# EAGLE design avr-remocon (EAGLE 8.3.1)
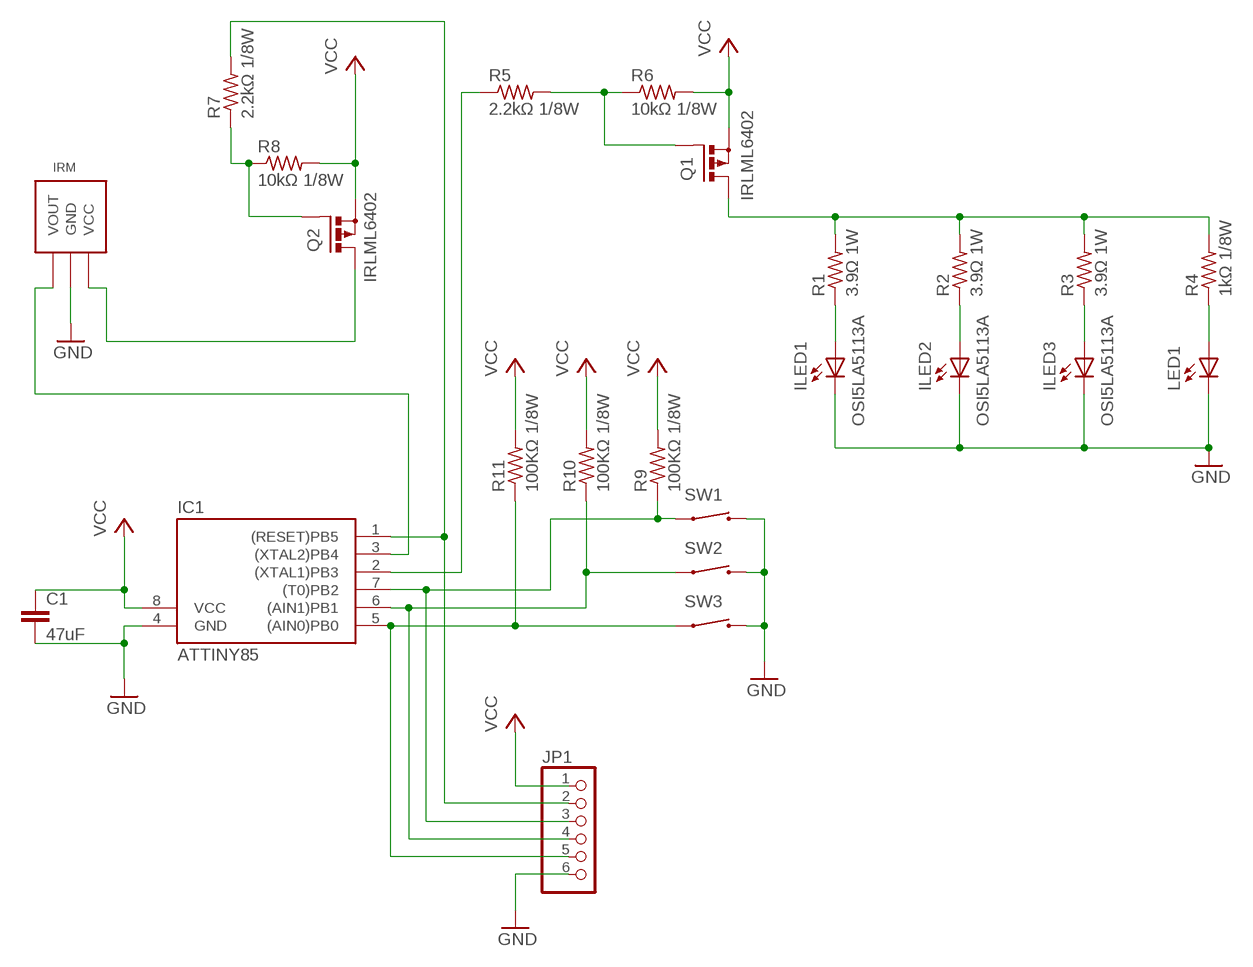
[diagram p0: schematic, sheet 1]

## Parts
C1  47uF  C-EUC3216  [C3216]
IC1  ATTINY85  TINY10S  [SOIC8]
ILED1  OSI5LA5113A  LED-SIDEDOWN3  [LED5MM-SIDE-DOWN3]
ILED2  OSI5LA5113A  LED-SIDEDOWN3  [LED5MM-SIDE-DOWN3]
ILED3  OSI5LA5113A  LED-SIDEDOWN3  [LED5MM-SIDE-DOWN3]
IRM  IRM2161  [IRM2161]
JP1  PINHD-1X6  [1X06]
LED1  LG_T679-E1F1-1  [PLCC2]
Q1  IRLML6402  [SOT-23]
Q2  IRLML6402  [SOT-23]
R1  3.9Ω 1W  R-US_R2512W  [R2512W]
R2  3.9Ω 1W  R-US_R2512W  [R2512W]
R3  3.9Ω 1W  R-US_R2512W  [R2512W]
R4  1kΩ 1/8W  R-US_R0805  [R0805]
R5  2.2kΩ 1/8W  R-US_R0805  [R0805]
R6  10kΩ 1/8W  R-US_R0805  [R0805]
R7  2.2kΩ 1/8W  R-US_R0805  [R0805]
R8  10kΩ 1/8W  R-US_R0805  [R0805]
R9  100KΩ 1/8W  R-US_R0805  [R0805]
R10  100KΩ 1/8W  R-US_R0805  [R0805]
R11  100KΩ 1/8W  R-US_R0805  [R0805]
SW1  RUBBER-SWITCH  [HALF-PITCH]
SW2  RUBBER-SWITCH  [HALF-PITCH]
SW3  RUBBER-SWITCH  [HALF-PITCH]

## Nets
GND: C1.2 IC1.4(GND) ILED1.K(C) ILED2.K(C) ILED3.K(C) IRM.P$2(GND) JP1.6 LED1.C SW1.P2 SW2.P2 SW3.P2
N$1: Q1.P3(D) R1.2 R2.2 R3.2 R4.2
N$2: IC1.2((XTAL1)PB3) R5.1
N$3: ILED1.A R1.1
N$4: Q1.P1(G) R5.2 R6.1
N$5: ILED2.A R2.1
N$6: IC1.3((XTAL2)PB4) IRM.P$1(VOUT)
N$7: ILED3.A R3.1
N$8: LED1.A R4.1
N$9: IRM.P$3(VCC) Q2.P3(D)
N$10: Q2.P1(G) R7.1 R8.1
N$11: IC1.5((AIN0)PB0) JP1.5 R11.1 SW3.P1
N$13: IC1.6((AIN1)PB1) JP1.4 R10.1 SW2.P1
N$14: IC1.7((T0)PB2) JP1.3 R9.1 SW1.P1
N$15: IC1.1((RESET)PB5) JP1.2 R7.2
VCC: C1.1 IC1.8(VCC) JP1.1 Q1.P2(S) Q2.P2(S) R6.2 R8.2 R9.2 R10.2 R11.2

## Library data of the parts
C1 = rcl:C-EU: CAPACITOR, European symbol
IC1 = atmel:TINY10: MICROCONTROLLER 1 Kbytes ROM; OC_FARNELL: unknown; OC_NEWARK: unknown
ILED1-ILED3 = led-side:LED-SIDE
IRM = IRM2161:IRM2161
JP1 = pinhead:PINHD-1X6: PIN HEADER
LED1 = led:*_T679-?-1: LC TOPLED® Low Current LED Source: http://catalog.osram-os.com .. LG_LS_LY_T679_OBS.pdf; COLOR: green
Q1 Q2 = mosfet:IRLML6402
R1-R11 = rcl:R-US_: RESISTOR, American symbol
SW1-SW3 = rubber-switch:RUBBER-SWITCH

## Board
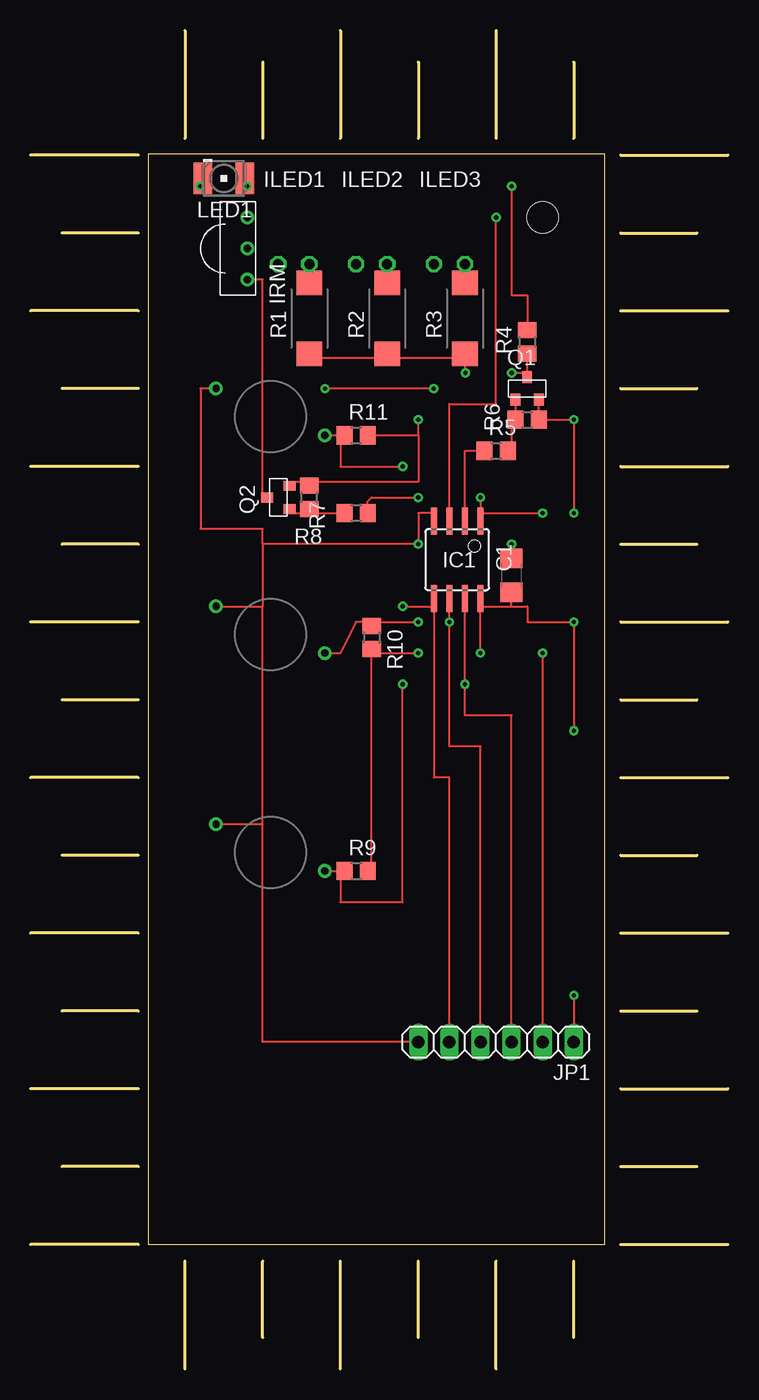
[diagram p1: board, top side]
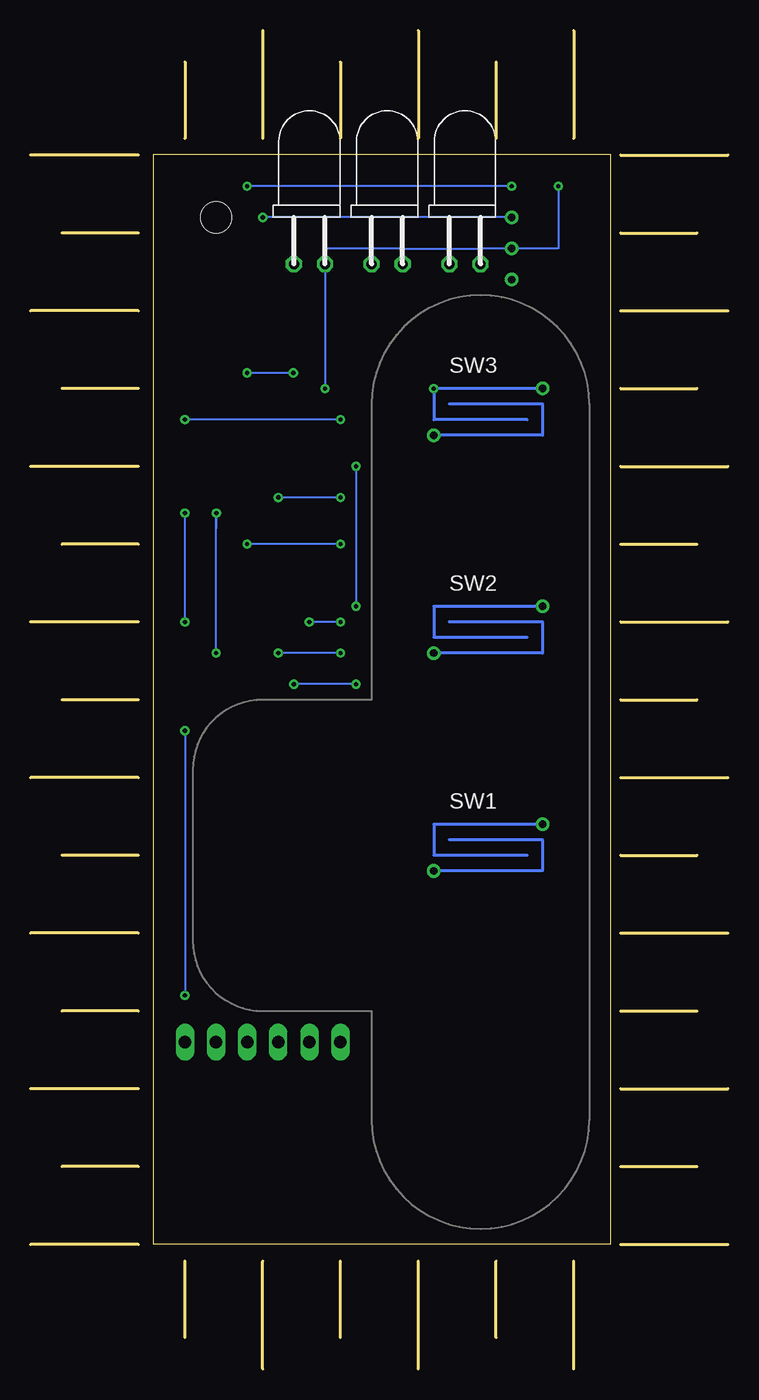
[diagram p2: board, bottom side, seen from below]

Size 56.95 x 109.22 mm. Coordinates in mm from the lower left corner, seen from the top.
Outline: 48.16,10.16 56.95,10.16
Outline: 48.16,16.51 54.41,16.51
Outline: 48.16,22.86 56.95,22.86
Outline: 48.16,29.21 54.41,29.21
Outline: 48.16,35.56 56.95,35.56
Outline: 48.16,41.91 54.41,41.91
Outline: 48.16,48.26 56.95,48.26
Outline: 48.16,54.61 54.41,54.61
Outline: 48.16,60.96 56.95,60.96
Outline: 48.16,67.31 54.41,67.31
Outline: 48.16,73.66 56.95,73.66
Outline: 48.16,80.01 54.41,80.01
Outline: 48.16,86.36 56.95,86.36
Outline: 48.16,92.71 54.41,92.71
Outline: 48.16,99.06 56.95,99.06
Outline: 12.6,0 12.6,8.79
Outline: 18.95,2.54 18.95,8.79
Outline: 25.3,0 25.3,8.79
Outline: 31.65,2.54 31.65,8.79
Outline: 38,0 38,8.79
Outline: 44.35,2.54 44.35,8.79
Outline: 44.35,106.68 44.35,100.43
Outline: 38,109.22 38,100.43
Outline: 31.65,106.68 31.65,100.43
Outline: 25.3,109.22 25.3,100.43
Outline: 18.95,106.68 18.95,100.43
Outline: 12.6,109.22 12.6,100.43
Outline: 8.79,99.06 0,99.06
Outline: 8.79,92.71 2.54,92.71
Outline: 8.79,86.36 0,86.36
Outline: 8.79,80.01 2.54,80.01
Outline: 8.79,73.66 0,73.66
Outline: 8.79,67.31 2.54,67.31
Outline: 8.79,60.96 0,60.96
Outline: 8.79,54.61 2.54,54.61
Outline: 8.79,48.26 0,48.26
Outline: 8.79,41.91 2.54,41.91
Outline: 8.79,35.56 0,35.56
Outline: 8.79,29.21 2.54,29.21
Outline: 8.79,22.86 0,22.86
Outline: 8.79,16.51 2.54,16.51
Outline: 8.79,10.16 0,10.16
Outline: 9.6,10.16 46.89,10.16 46.89,99.14 9.6,99.14 9.6,10.16
Copper layers (1*16): Top 0.035mm / dielectric 1.5mm / Bottom 0.035mm
Design rules "default *": minimum track width 6mil, minimum drill 0.35mm, track to track 6mil, track to pad 6mil, pad to pad 6mil, via to via 6mil, smd to smd 6mil, copper to edge 40mil, drill to drill 6mil, minimum pad ring 10mil, minimum via ring 8mil, stop-mask expansion 2mil, vias tented up to drill 0mil, thermal gap 10mil
Holes 2.54 mm at 41.81,93.98
tRestrict: area 12.6,81.9 to 17.4,87.6; area 41.8,81.3 to 46.9,86.4; area 40.8,62.2 to 46.9,67.3; area 42.1,39.4 to 46.9,44.5; area 10.1,62.2 to 15.1,67.3; area 10.1,39.4 to 14.5,44.5
vRestrict: area 9.6,10.2 to 12.6,99.1; area 8.8,10.2 to 46.9,13.2; area 41.2,97.2 to 42.4,99.1; area 45,92.1 to 46.9,93.3

### Footprints (pad centres in the part's own frame; a part is rotated, then mirrored left to right if it is on the bottom)
C3216 = smd 1.6 x 1.8: 1 -1.4,0; 2 1.4,0
SOIC8 = smd 0.5 x 2.2: 1 -1.905,-3.154; 2 -0.645,-3.154; 3 0.625,-3.154; 4 1.895,-3.154; 5 1.905,3.154; 6 0.635,3.154; 7 -0.635,3.154; 8 -1.905,3.154
LED5MM-SIDE-DOWN3 = drill 0.813 octagon: A -1.27,0; K 1.27,0
IRM2161 = drill 0.6: P$1 -2.54,0; P$2 0,0; P$3 2.54,0
1X06 = drill 1.016 long: 1 -6.35,0; 2 -3.81,0; 3 -1.27,0; 4 1.27,0; 5 3.81,0; 6 6.35,0
PLCC2 = smd 2.6 x 1.5: A 0,1.7; C 0,-1.7
SOT-23 = smd 0.802 x 0.972: P1 -0.95,-0.917; P2 0.95,-0.917; P3 0,0.917
R2512W = smd 2 x 2.1: 1 -2.896,0; 2 2.896,0
R0805 = smd 1.3 x 1.5: 1 -0.95,0; 2 0.95,0
HALF-PITCH = drill 0.6: P1 1.27,-5.08; P2 -2.54,3.81

### Placement (x,y rotation side)
C1  39.27,64.77 90 top
IC1  34.82,66.04 180 top
ILED1  21.49,90.17 180 top
ILED2  27.84,90.17 180 top
ILED3  34.19,90.17 180 top
IRM  17.68,91.44 270 top
JP1  38,26.67 180 top
LED1  15.77,97.16 270 top
Q1  40.54,80.01 0 top
Q2  20.22,71.12 90 top
R1  22.76,85.72 270 top
R2  29.11,85.72 270 top
R3  35.46,85.72 270 top
R4  40.54,83.82 270 top
R5  38,74.93 0 top
R6  40.54,77.47 0 top
R7  26.57,69.85 0 top
R8  22.76,71.12 90 top
R9  26.57,40.64 0 top
R10  27.84,59.69 270 top
R11  26.57,76.2 0 top
SW1  18.95,41.91 270 bottom
SW2  18.95,59.69 270 bottom
SW3  18.95,77.47 270 bottom

### Tracks (layer width: path | path; a pad name or v marks a point on that pad's centre or on a via)
GND  (via drill 0.35)
  Top 0.152: SW3.P2 13.87,80.01 13.87,68.58 18.95,68.58 18.95,67.31 | 18.95,67.31 18.95,62.23 | SW2.P2 18.95,62.23 | 18.95,44.45 SW1.P2 | 18.95,44.45 18.95,62.23 | v32.92,80.01 v24.03,80.01 | JP1.6 18.95,26.67 18.95,44.45 | IC1.4 32.92,69.85 31.65,69.85 v31.65,67.31 18.95,67.31 | v39.27,67.31 C1.2 | LED1.C v13.87,96.52
  Bottom 0.152: 20.22,91.44 IRM.P$2 13.87,91.44 v13.87,96.52 | 20.22,91.44 ILED1.K | ILED2.K 26.57,91.44 | 26.57,91.44 20.22,91.44 | 26.57,91.44 32.89,91.44 32.92,91.41 | 32.92,91.41 ILED3.K v32.92,80.01 | 32.92,91.41 32.95,91.44 | v31.65,67.31 v39.27,67.31
N$1  (via drill 0.35)
  Top 0.152: 35.46,81.32 v35.5,81.28 35.46,81.32 | R1.2 22.76,82.55 28.83,82.55 R2.2 29.11,82.55 35.43,82.55 35.46,82.52 R3.2 35.46,81.32 | 40.54,81.28 v39.27,81.28 | 40.54,81.28 R4.2 | Q1.P3 40.54,81.28
  Bottom 0.152: v35.5,81.28 v39.27,81.28
N$2
  Top 0.152: IC1.2 35.46,69.2 35.46,74.93 R5.1
N$3
  Top 0.152: ILED1.A R1.1
N$4
  Top 0.152: Q1.P1 R6.1 39.27,77.47 39.27,76.2 39.27,75.25 R5.2
N$5
  Top 0.152: ILED2.A R2.1
N$6  (via drill 0.35)
  Top 0.152: 34.19,69.85 34.2,69.84 IC1.3 34.19,69.85 | v38,93.98 38,78.74 34.19,78.74 34.19,69.85
  Bottom 0.152: IRM.P$1 v38,93.98
N$7
  Top 0.152: ILED3.A R3.1
N$8  (via drill 0.35)
  Top 0.152: LED1.A v17.68,96.52 | R4.1 40.54,87.63 39.27,87.63 v39.27,96.52
  Bottom 0.152: v17.68,96.52 v39.27,96.52
N$9
  Top 0.152: Q2.P3 18.95,71.12 18.95,88.9 IRM.P$3
N$10
  Top 0.152: Q2.P1 21.17,70.17 21.49,69.85 22.44,69.85 R8.1 22.76,69.85 R7.1
N$11  (via drill 0.35)
  Top 0.152: JP1.5 34.19,48.26 32.92,48.26 32.92,62.23 | 32.92,62.23 IC1.5 | SW3.P1 25.3,76.2 | R11.1 25.3,76.2 | 25.3,76.2 25.3,73.66 v30.38,73.66 | v30.38,62.23 32.92,62.23
  Bottom 0.152: v30.38,73.66 v30.38,62.23
N$13  (via drill 0.35)
  Top 0.152: SW2.P1 25.3,58.42 26.56,60.95 27.84,60.96 | JP1.4 36.73,50.8 34.19,50.8 34.19,53.34 v34.19,60.96 IC1.6 | R10.1 27.84,60.96 | 27.84,60.96 v31.65,60.96
  Bottom 0.152: v31.65,60.96 v34.19,60.96
N$14  (via drill 0.35)
  Top 0.152: JP1.3 39.27,53.34 35.46,53.34 v35.46,55.88 IC1.7 | SW1.P1 R9.1 25.3,40.64 25.3,38.1 30.38,38.1 v30.38,55.88
  Bottom 0.152: v30.38,55.88 v35.46,55.88
N$15  (via drill 0.35)
  Top 0.152: JP1.2 v41.81,58.42 | 36.73,69.85 36.73,69.69 IC1.1 | 36.73,69.85 v41.79,69.85 41.81,69.85 | R7.2 27.52,70.8 27.84,71.12 v31.65,71.12 | v36.73,71.12 36.73,69.85
  Bottom 0.152: 41.82,68.58 v41.79,69.85 41.81,68.56 v41.81,58.42 | v31.65,71.12 v36.73,71.12
VCC  (via drill 0.35)
  Top 0.152: Q2.P2 21.17,72.07 21.49,72.39 22.44,72.39 22.61,72.22 | v44.35,52.07 v44.35,60.96 40.54,60.96 40.54,62.23 39.27,62.23 | v44.35,30.48 JP1.1 | 39.27,62.23 36.73,62.23 IC1.8 v36.73,58.42 | 39.27,62.23 C1.1 | 22.61,72.22 R8.2 | R11.2 31.65,76.2 | 31.65,76.2 31.65,72.39 22.77,72.39 22.61,72.22 | 27.84,58.42 R10.2 | 27.84,58.42 v31.65,58.42 | R9.2 27.84,40.64 27.84,58.42 | Q1.P2 R6.2 44.24,77.47 44.35,77.36 | 31.65,76.2 v31.65,77.47 | v44.35,77.47 44.35,77.36 | 44.35,77.36 v44.35,69.85
  Bottom 0.152: v44.35,52.07 v44.35,30.48 | v31.65,58.42 v36.73,58.42 | v44.35,60.96 v44.35,69.85 | v31.65,77.47 v44.35,77.47